# EAGLE schematic PCB1M1A1 (EAGLE 6.2)
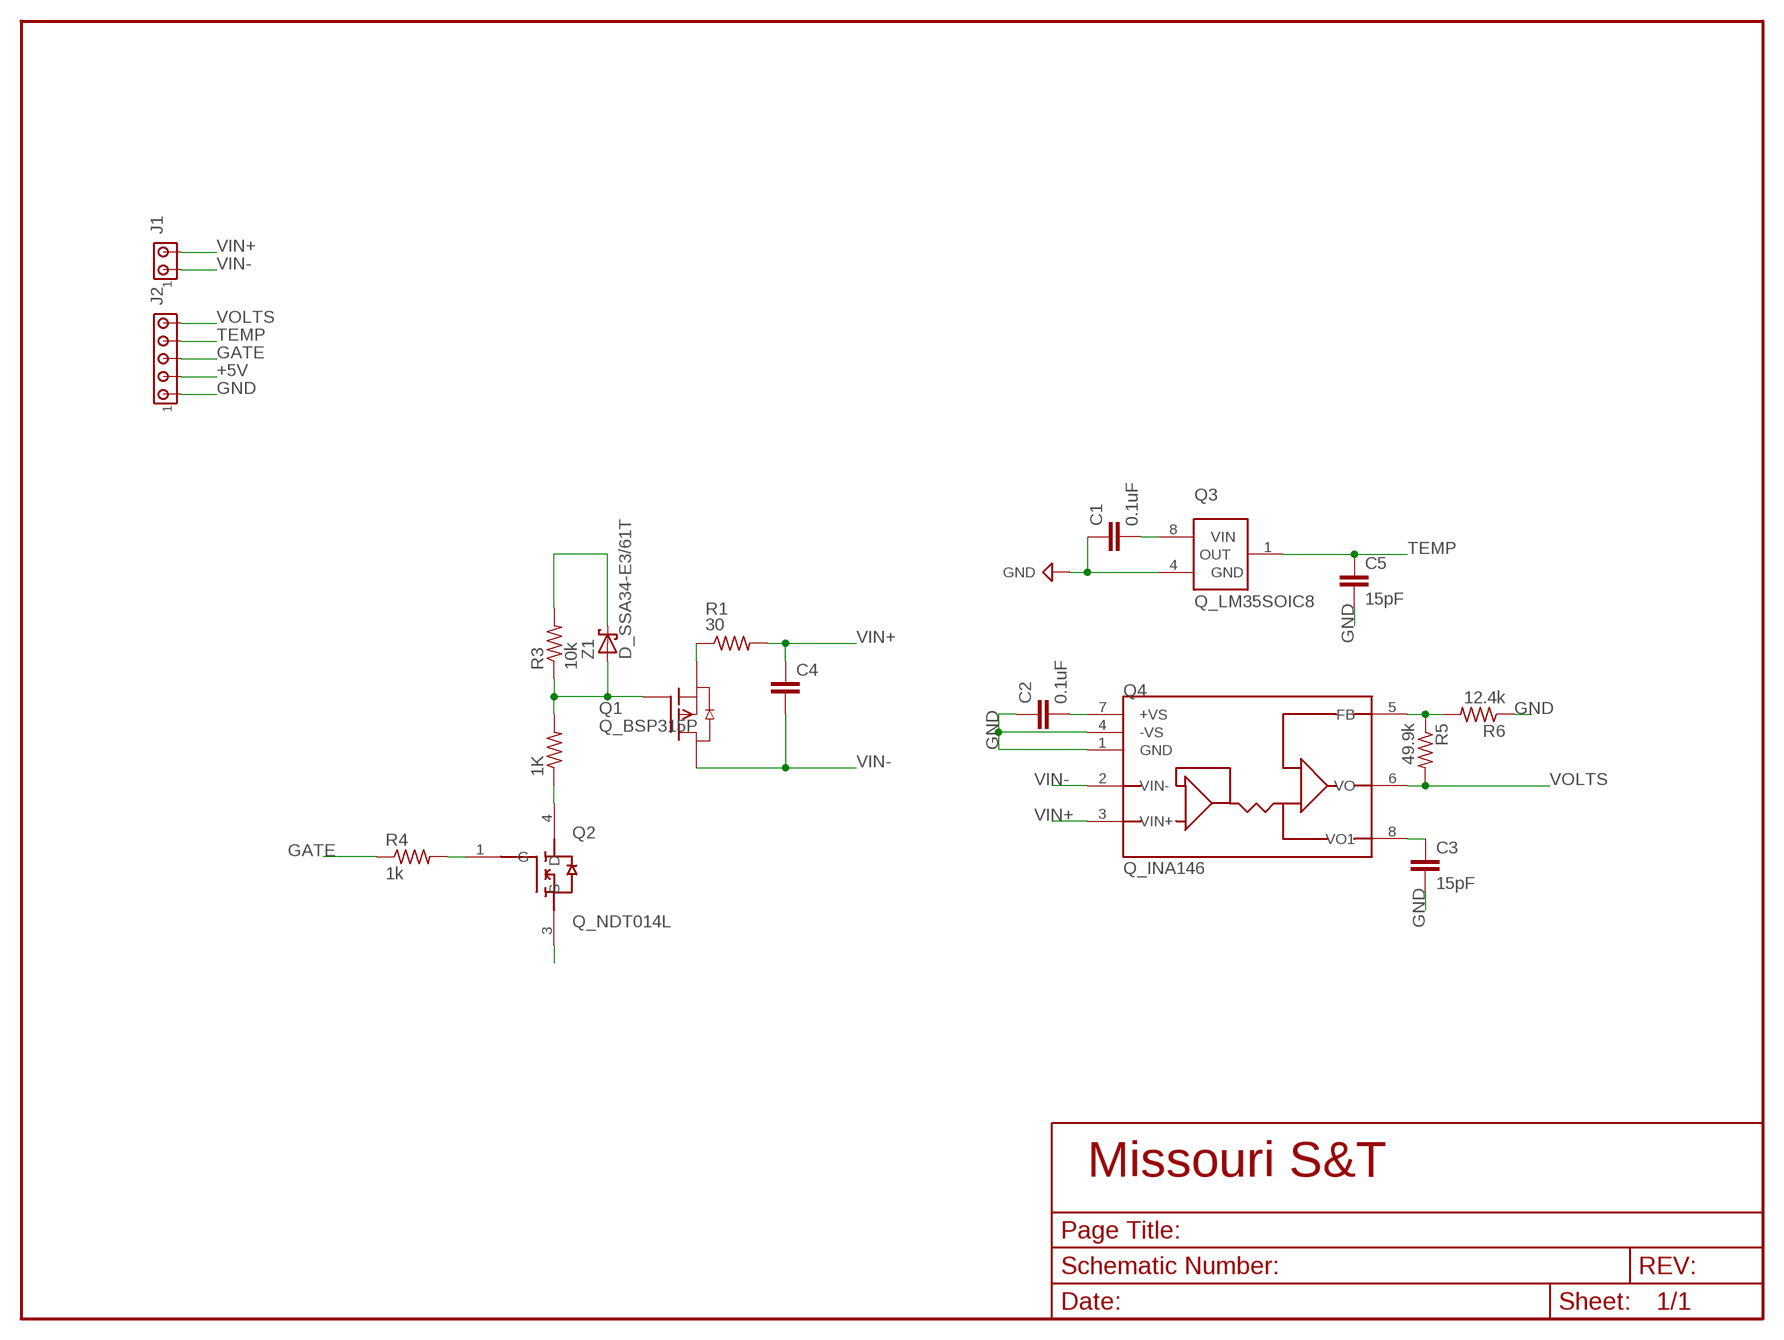
[diagram p0: schematic, sheet 1]

## Parts
1K  R_RES_1206  [R_1206]
C1  0.1uF  C_CAP_1206  [C_1206]
C2  0.1uF  C_CAP_1206  [C_1206]
C3  15pF  C_CAP_1206  [C_1206]
C4  C_CAP_1206  [C_1206]
C5  15pF  C_CAP_1206  [C_1206]
J1  J_MTA2P_100  [J_MTA100_2P]
J2  J_MTA5P_100  [J_MTA100_5P]
Q1  Q_BSP315P  [SOT-223]
Q2  Q_NDT014L  [SOT-223]
Q3  Q_LM35SOIC8  [SOIC8]
Q4  Q_INA146  [SOIC8]
R1  30  R_2512  [R_2512]
R3  10k  R_RES_1206  [R_1206]
R4  1k  R_RES_1206  [R_1206]
R5  49.9k  R_RES_1206  [R_1206]
R6  12.4k  R_RES_1206  [R_1206]
Z1  D_SSA34-E3/61T  [D_DO214AC]

## Nets
+5V: C1.2 C2.2 J2.2 Q3.8(VIN) Q4.7(+VS)
GATE: J2.3 R4.1
GND: C1.1 C2.1 C3.2 C5.2 J2.1 Q2.3(S) Q3.4(GND) Q4.1(GND) Q4.4(-VS) R6.1 ; supply symbol labelled SUP_GND
N$2: Q1.4(S) R1.P$1
N$4: R3.2 Z1.C
N$7: 1K.1 Q2.4(D)
N$9: Q2.1(G) R4.2
N$13: Q4.5(FB) R5.1 R6.2
N$14: C3.1 Q4.8(VO1)
TEMP: C5.1 J2.4 Q3.1(OUT)
VIN+: C4.1 J1.2 Q4.3(VIN+) R1.P$2
VIN-: C4.2 J1.1 Q1.3(D) Q4.2(VIN-)
VOLTS: J2.5 Q4.6(VO) R5.2
Z1: 1K.2 Q1.1(G) R3.1 Z1.A

## Library data of the parts
1K R3-R6 = Lib_Passive:R_RES
C1-C5 = Lib_Passive:C_CAP
J1 = Lib_TH:J_MTA2P
J2 = Lib_TH:J_MTA5P
Q1 = PCB0M1:Q_BSP315P
Q2 = PCB0M1:Q_NDT014L
Q3 = PCB0M1:Q_LM35: IC, TEMPERATURE SENSOR, 0.4°C, TO-92-3
Q4 = PCB0M1:Q_INA146: High Voltage Differential Amplifier
R1 = PCB0M1:R_2512
Z1 = EE371:D_SSA34-E3/61T: SCHOTTKY RECTIFIER, 3A 40V DO-214AC